# Altium project ePBR25_ACU_Latching.PrjPCB (part 2 of 2)

## Sheet 4e - Brake Detection.SchDoc
size A4
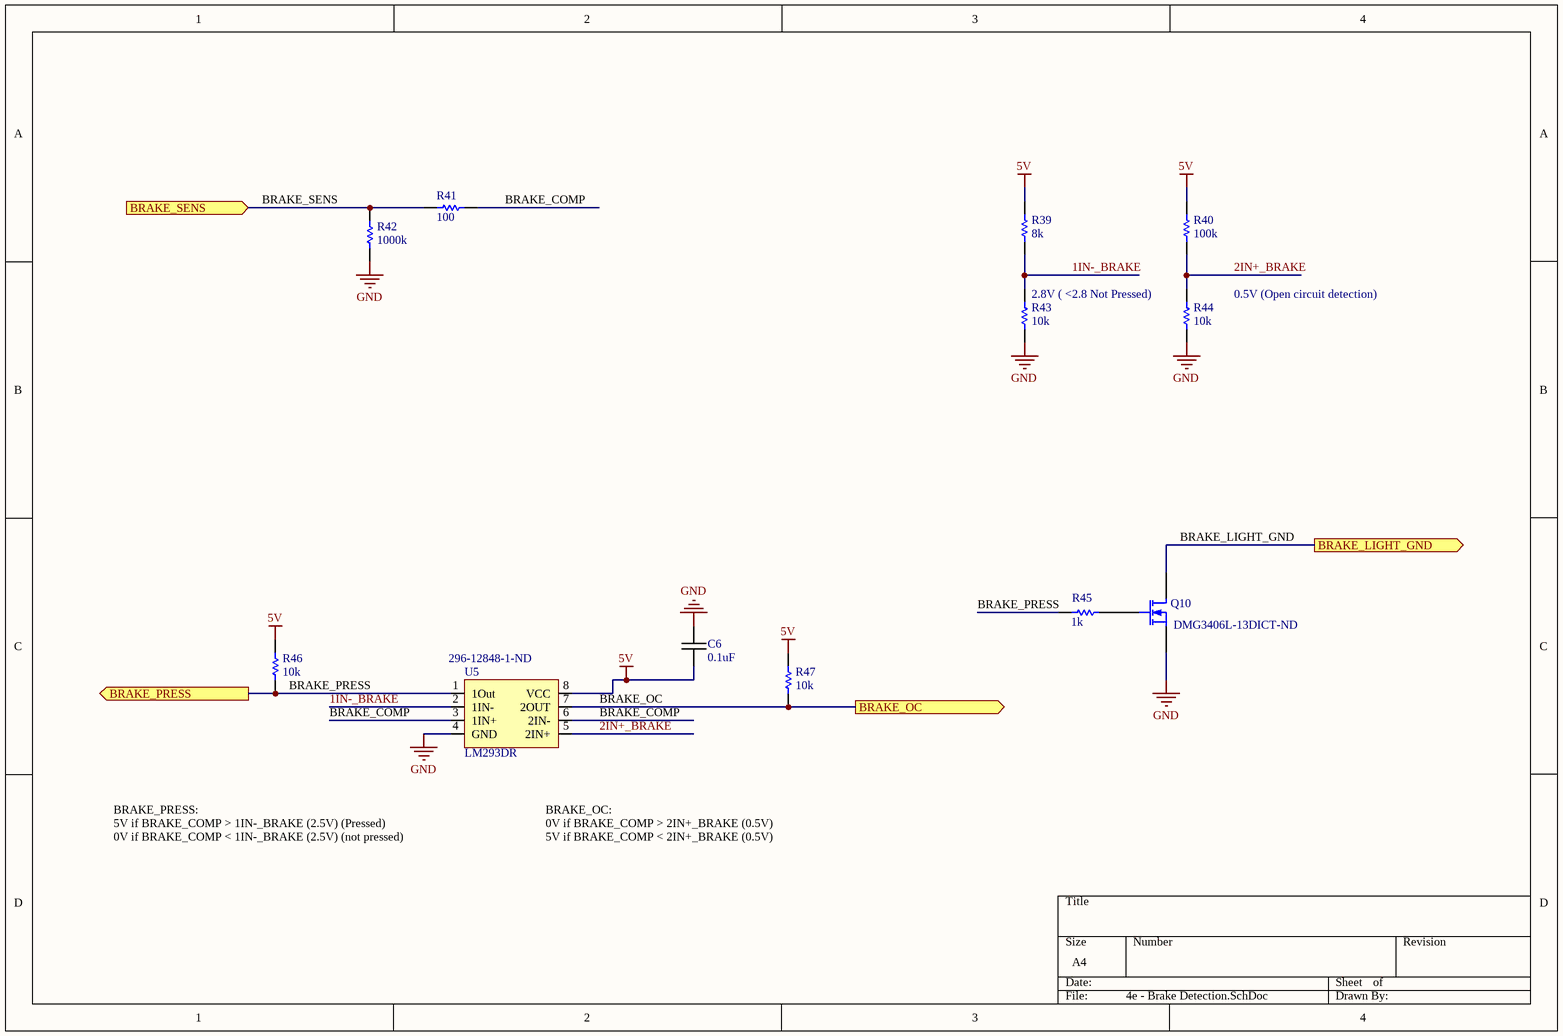
[diagram p5: 4e - Brake Detection.SchDoc]

### Parts
C6  value 0.1uF  [1608[0603]]  (hidden comment: 100nF)
Q10  Supplier Part Number 1: DMG3406L-13DICT-ND  [SOT-23_N]
R39  Resistance (Ohms): 8k  [1608[0603]]  (hidden comment: Volt. Div. R1)
R40  Resistance (Ohms): 100k  [1608[0603]]  (hidden comment: Volt. Div. R1)
R41  value 100  [1608[0603]]  (hidden comment: Volt. Div. R2)
R42  value 1000k  [1608[0603]]  (hidden comment: Volt. Div. R2)
R43  value 10k  [1608[0603]]  (hidden comment: Volt. Div. R2)
R44  value 10k  [1608[0603]]  (hidden comment: Volt. Div. R2)
R45  1k  [RESC0603(1608)_L]
R46  value 10k  [1608[0603]]  (hidden comment: Volt. Div. R2)
R47  value 10k  [1608[0603]]  (hidden comment: Volt. Div. R2)
U5  LM293DR  Supplier Part Number 1: 296-12848-1-ND  [LM293DR]

### Ports
BRAKE_LIGHT_GND (out), BRAKE_OC (out), BRAKE_PRESS (out), BRAKE_SENS (in)

### Nets
5V: C6.1 R39.2 R40.2 R46.2 R47.2 U5.8(VCC)
GND: C6.2 Q10.2(S) R42.1 R43.1 R44.1 U5.4(GND)
1IN-_BRAKE: R39.1 R43.2 U5.2(1IN-)
2IN+_BRAKE: R40.1 R44.2 U5.5(2IN+)
BRAKE_COMP: R41.1 U5.3(1IN+) U5.6(2IN-)
BRAKE_LIGHT_GND: Q10.3(D) ; port BRAKE_LIGHT_GND
BRAKE_OC: R47.1 U5.7(2OUT) ; port BRAKE_OC
BRAKE_PRESS: R45.1 R46.1 U5.1(1Out) ; port BRAKE_PRESS
BRAKE_SENS: R41.2 R42.2 ; port BRAKE_SENS
NetQ10_1: Q10.1(G) R45.2

### Notes on the sheet
- 2.8V ( <2.8 Not Pressed)
- 0.5V (Open circuit detection)
- BRAKE_PRESS:
  5V if BRAKE_COMP > 1IN-_BRAKE (2.5V) (Pressed)
  0V if BRAKE_COMP < 1IN-_BRAKE (2.5V) (not pressed)
- BRAKE_OC:
  0V if BRAKE_COMP > 2IN+_BRAKE (0.5V)
  5V if BRAKE_COMP < 2IN+_BRAKE (0.5V)

### Library data of the parts
C6 = 0805C-100nF-25V-X7R-MUR: CAP CER 0.1UF 50V X7R 0603; Manufacturer: Kemet; Manufacturer Part Number: C0603C104K5RACAUTO; Capacitance: 0.1µF; Tolerance: ±10%; Supplier 1: Digi-Key; Supplier Part Number 1: 399-6856-1-ND; RoHS: RoHS Compliant; Category: Capacitors; Stock 1: 157876; Pricing 1: 1=0.14, 10=0.095, 25=0.0672, 50=0.0514, 100=0.0435, 250=0.03556, 1000=0.02324 (CAD); Packaging: Cut Tape (CT); Voltage - Rated: 50V; Temperature Coefficient: X7R; Mounting Type: Surface Mount, MLCC; Operating Temperature: -55°C ~ 125°C; Applications: Automotive; Ratings: AEC-Q200; Package / Case: 0603 (1608 Metric); Size / Dimension: 0.063" L x 0.031" W (1.60mm x 0.80mm); Height - Seated (Max): -; Thickness (Max): 0.034" (0.87mm); Lead Spacing: -; Features: -; Lead Style: -; ComponentLink1URL: http://capacitoredge.kemet.com/capedge2/DataSheet?pn=C0603C104K5RACAUTO; ComponentLink1Description: http://capacitoredge.kemet.com/capedge2/DataSheet?pn=C0603C104K5RACAUTO
Q10 = MOSFET-N: N-Channel MOSFET; Manufacturer: Infineon Technologies; FET Type: MOSFET N-Channel, Metal Oxide; FET Feature: Logic Level Gate; Drain to Source Voltage (Vdss): 30V; Current - Continuous Drain (Id) @ 25°C: 50A (Tc); Rds On (Max) @ Id, Vgs: 7.5 mOhm @ 30A, 10V; Vgs(th) (Max) @ Id: 2.2V @ 250µA; Gate Charge (Qg) @ Vgs: 18nC @ 10V; Input Capacitance (Ciss) @ Vds: 1900pF @ 15V; Power - Max: 47W; Published: 8-Jun-2000; LatestRevisionDate: 17-Jul-2002; LatestRevisionNote: Re-released for DXP Platform.; PackageVersion: 1995/1996; PackageReference: E3; Publisher: Altium Limited; PackageDescription: TO, Flat Index; 3 In-Line, Axial Leads; Body Dia. 4.6mm; Lead Dia. 0.5 mm (max); RoHS: RoHS Compliant; Category: Discrete Semiconductor Products; Packaging: Cut Tape (CT); Mounting Type: Surface Mount; Package / Case: TO-252-3, DPak (2 Leads + Tab), SC-63; Supplier Device Package: PG-TO252-3; ComponentLink1URL: http://www.infineon.com/dgdl/Infineon-IPD075N03LG-DS-v02_01-en.pdf?folderId=5546d4694909da4801490a07012f053b&fileId=db3a30431936bc4b011951d824f83aeb; ComponentLink1Description: http://www.infineon.com/dgdl/Infineon-IPD075N03LG-DS-v02_01-en.pdf?folderId=5546d4694909da4801490a07012f053b&fileId=db3a30431936bc4b011951d824f83aeb; ComponentLink2URL: http://www.semicon.toshiba.co.jp/info/docget.jsp?type=datasheet&lang=en&pid=SSM3K329R; ComponentLink2Description: http://www.semicon.toshiba.co.jp/info/docget.jsp?type=datasheet&lang=en&pid=SSM3K329R; Supplier 1: Digi-Key
R39 R40 = Res1: RES SMD 6.8K OHM 5% 1/4W 0603; Manufacturer: Rohm Semiconductor; Manufacturer Part Number: ESR03EZPJ682; Power (Watts): 0.25W, 1/4W; Temperature Coefficient: ±200ppm/°C; RoHS: RoHS Compliant; Category: Resistors; Stock 1: 2440; Pricing 1: 1=0.15, 10=0.119, 25=0.0824, 50=0.0642, 100=0.0458, 250=0.03568, 500=0.02836, 1000=0.02012 (CAD); Packaging: Cut Tape (CT); Part Status: Active; Tolerance: ±5%; Composition: Thick Film; Features: Automotive AEC-Q200, Pulse Withstanding; Operating Temperature: -55°C ~ 155°C; Package / Case: 0603 (1608 Metric); Supplier Device Package: 0603; Size / Dimension: 0.063" L x 0.031" W (1.60mm x 0.80mm); Height - Seated (Max): 0.022" (0.55mm); Failure Rate: -; ComponentLink1URL: http://rohmfs.rohm.com/en/products/databook/datasheet/passive/resistor/chip_resistor/esr.pdf; ComponentLink1Description: http://rohmfs.rohm.com/en/products/databook/datasheet/passive/resistor/chip_resistor/esr.pdf; Supplier 1: Digi-Key
  R39: Supplier Part Number 1: 311-300KGRCT-ND
  R40: Supplier Part Number 1: 311-100KHRCT-ND
R41-R44 R46 R47 = Res1: RES SMD 20K OHM 5% 1/4W 0603; Manufacturer: Rohm Semiconductor; Manufacturer Part Number: ESR03EZPJ203; Power (Watts): 0.25W, 1/4W; Temperature Coefficient: ±200ppm/°C; Published: 8-Jun-2000; LatestRevisionDate: 17-Jul-2002; LatestRevisionNote: Re-released for DXP Platform.; PackageReference: AXIAL-0.3; Publisher: Altium Limited; PackageDescription: Axial Device, Thru-Hole; 2 Leads; 0.3 in Pin Spacing; RoHS: RoHS Compliant; Category: Resistors; Stock 1: 50602; Pricing 1: 1=0.15, 10=0.121, 25=0.0832, 100=0.0463, 250=0.03604, 500=0.02866, 1000=0.02033 (CAD); Packaging: Cut Tape (CT); Resistance (Ohms): 20k; Tolerance: ±5%; Composition: Thick Film; Features: Automotive AEC-Q200, Pulse Withstanding; Operating Temperature: -55°C ~ 155°C; Package / Case: 0603 (1608 Metric); Supplier Device Package: 0603 (1608 Metric); Size / Dimension: 0.063" L x 0.031" W (1.60mm x 0.80mm); Height: 0.022" (0.55mm); Number of Terminations: 2; ComponentLink1URL: http://rohmfs.rohm.com/en/products/databook/datasheet/passive/resistor/chip_resistor/esr.pdf; ComponentLink1Description: http://rohmfs.rohm.com/en/products/databook/datasheet/passive/resistor/chip_resistor/esr.pdf; Supplier 1: Digi-Key
  R41: Supplier Part Number 1: 311-100HRDKR-ND
  R42: Supplier Part Number 1: 311-1.00MHRCT-ND
  R43: Supplier Part Number 1: YAG3633CT-ND
  R44 R46 R47: Supplier Part Number 1: 311-10KGRCT-ND
R45 = CMP-1591-00001-1: 0603 (1608 Metric) Chip Resistor; Case-Metric: 1608; Case-EIA: 0603; Value: 1k; PackageReference: RESC0603(1608); Supplier 1: Digi-Key; Supplier Part Number 1: 311-1.0KGRCT-ND
U5 = LM293DR: IC Dual Comparator; Supplier 1: Digi-Key

## Sheet 5  - Status Lights.SchDoc
size 330 x 228 mm
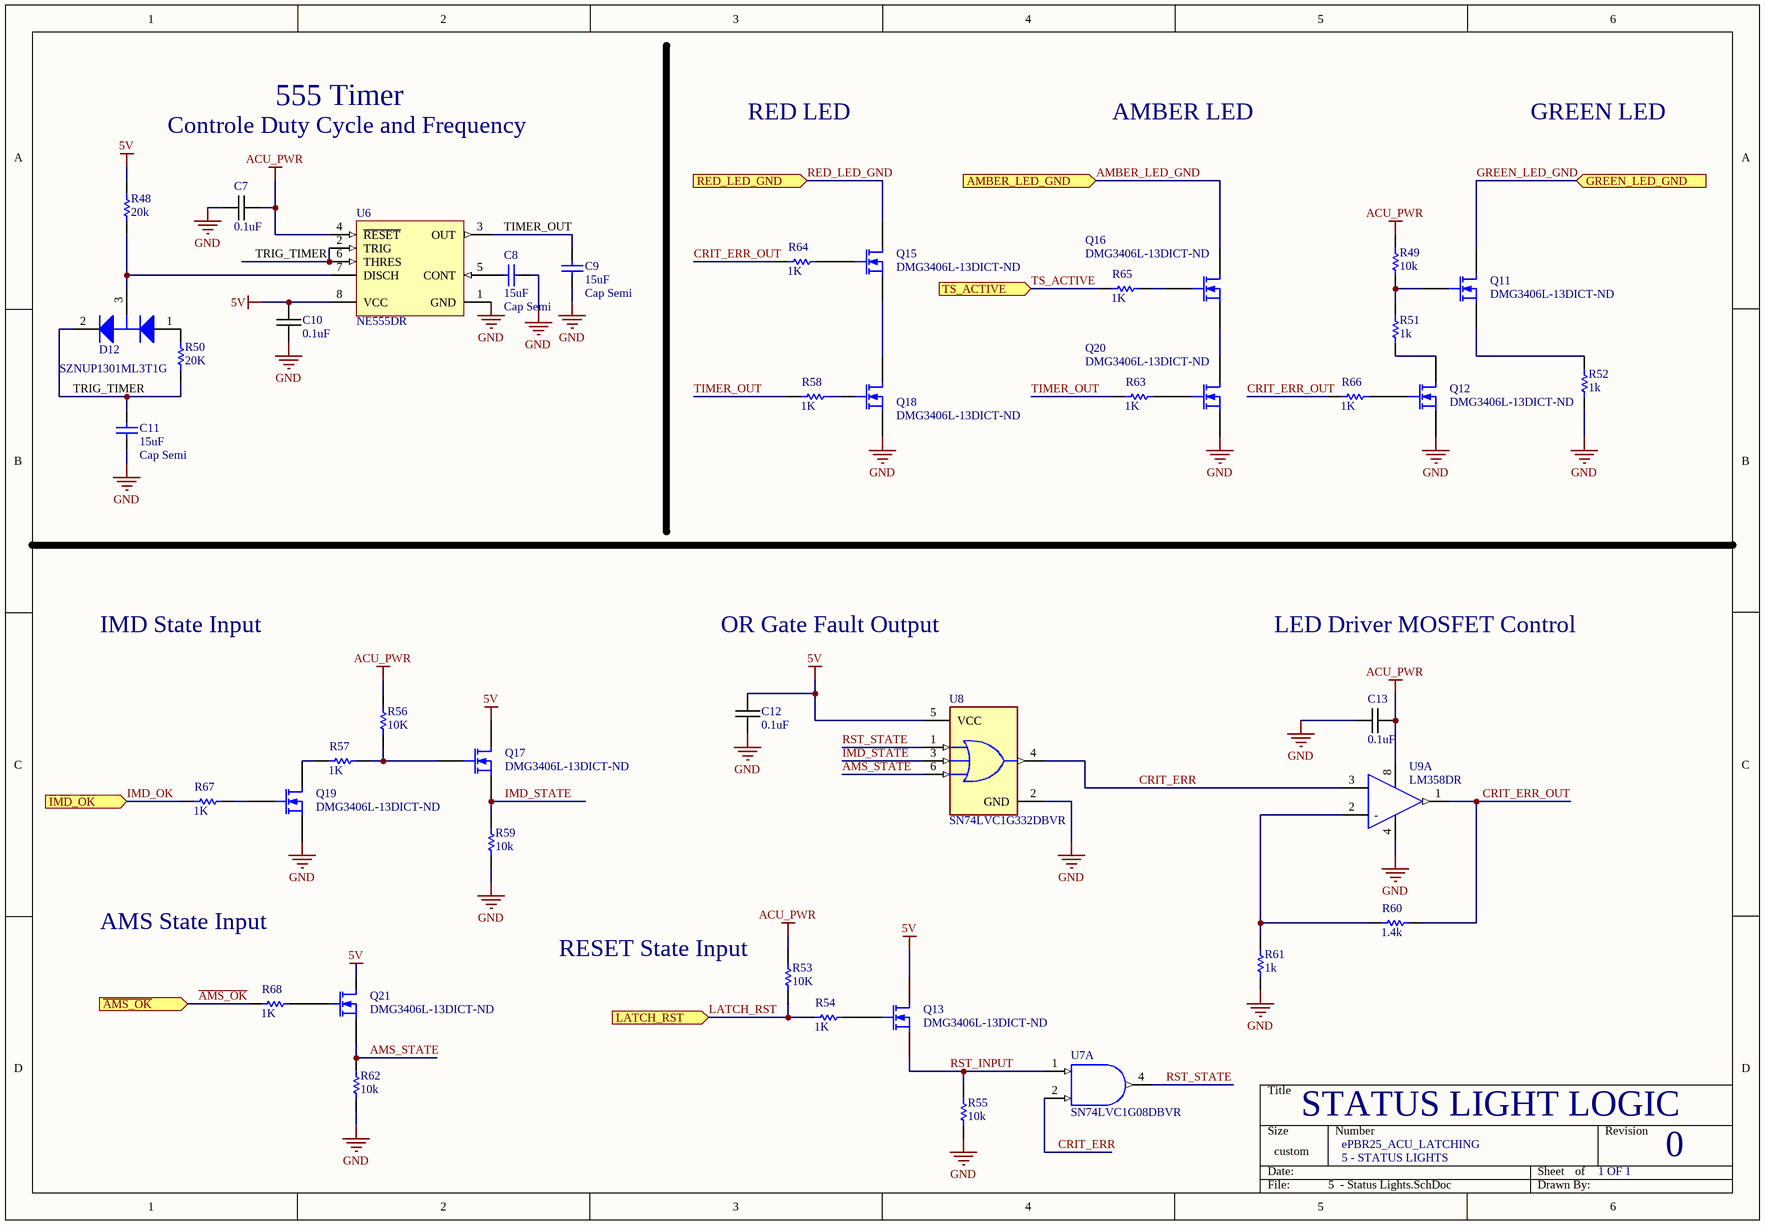
[diagram p6: 5  - Status Lights.SchDoc]

### Parts
C7  value 0.1uF  [1608[0603]]  (hidden comment: 100nF)
C8  Cap Semi  value 15uF  [1608[0603]]
C9  Cap Semi  value 15uF  [1608[0603]]
C10  value 0.1uF  [1608[0603]]  (hidden comment: 100nF)
C11  Cap Semi  value 15uF  [1608[0603]]
C12  value 0.1uF  [1608[0603]]  (hidden comment: 100nF)
C13  value 0.1uF  [1608[0603]]  (hidden comment: 100nF)
D12  SZNUP1301ML3T1G  [ONSC-SOT-23-3-318-08_V]
Q11  Supplier Part Number 1: DMG3406L-13DICT-ND  [SOT23-GDS]
Q12  Supplier Part Number 1: DMG3406L-13DICT-ND  [SOT23-GDS]
Q13  Supplier Part Number 1: DMG3406L-13DICT-ND  [SOT23-GDS]
Q15  Supplier Part Number 1: DMG3406L-13DICT-ND  [SOT23-GDS]
Q16  Supplier Part Number 1: DMG3406L-13DICT-ND  [SOT23-GDS]
Q17  Supplier Part Number 1: DMG3406L-13DICT-ND  [SOT23-GDS]
Q18  Supplier Part Number 1: DMG3406L-13DICT-ND  [SOT23-GDS]
Q19  Supplier Part Number 1: DMG3406L-13DICT-ND  [SOT23-GDS]
Q20  Supplier Part Number 1: DMG3406L-13DICT-ND  [SOT23-GDS]
Q21  Supplier Part Number 1: DMG3406L-13DICT-ND  [SOT23-GDS]
R48  20k  [RESC0603(1608)_L]
R49  10k  [RESC0603(1608)_L]
R50  20K  [RESC0603(1608)_L]
R51  1k  [RESC0603(1608)_L]
R52  1k  [RESC0603(1608)_L]
R53  10K  [RESC0603(1608)_L]
R54  1K  [RESC0603(1608)_L]
R55  10k  [RESC0603(1608)_L]
R56  10K  [RESC0603(1608)_L]
R57  1K  [RESC0603(1608)_L]
R58  1K  [RESC0603(1608)_L]
R59  10k  [RESC0603(1608)_L]
R60  1.4k  [RESC0603(1608)_L]
R61  1k  [RESC0603(1608)_L]
R62  10k  [RESC0603(1608)_L]
R63  1K  [RESC0603(1608)_L]
R64  1K  [RESC0603(1608)_L]
R65  1K  [RESC0603(1608)_L]
R66  1K  [RESC0603(1608)_L]
R67  1K  [RESC0603(1608)_L]
R68  1K  [RESC0603(1608)_L]
U6  NE555DR  [D0008A_M]
U7  SN74LVC1G08DBVR  [DBV0005A_M]  (part A of 2)
U8  SN74LVC1G332DBVR  [FP-DBV0006A-MFG]
U9  LM358DR  [FP-D0008A-MFG]  (part A of 2)

### Ports
AMBER_LED_GND (in), GREEN_LED_GND (in), IMD_OK (in), LATCH_RST (in), RED_LED_GND (in), TS_ACTIVE (in), ~{AMS_OK} (in)

### Nets
5V: C10.2 C12.1 Q13.3(D) Q17.3(D) Q21.3(D) R48.1 U6.8(VCC) U8.5(VCC)
ACU_PWR: C7.1 C13.2 R49.1 R53.2 R56.2 U6.4(~{RESET}) U9.8(V+)
GND: C7.2 C8.1 C9.2 C10.1 C11.2 C12.2 C13.1 Q12.2(S) Q18.2(S) Q19.2(S) Q20.2(S) R52.1 R55.2 R59.2 R61.2 R62.2 U6.1(GND) U8.2(GND) U9.4(V-)
~{AMS_OK}: R68.1 ; port ~{AMS_OK}
AMBER_LED_GND: Q16.3(D) ; port AMBER_LED_GND
AMS_STATE: Q21.2(S) R62.1 U8.6(C)
CRIT_ERR: U7.2(B) U8.4(Y) U9.3(IN1+)
CRIT_ERR_OUT: R60.2 R64.1 R66.1 U9.1(1OUT)
GREEN_LED_GND: Q11.3(D) ; port GREEN_LED_GND
IMD_OK: R67.1 ; port IMD_OK
IMD_STATE: Q17.2(S) R59.1 U8.3(B)
LATCH_RST: R53.1 R54.1 ; port LATCH_RST
RED_LED_GND: Q15.3(D) ; port RED_LED_GND
RST_INPUT: Q13.2(S) R55.1 U7.1(A)
RST_STATE: U7.4(Y) U8.1(A)
TIMER_OUT: C9.1 R58.1 R63.1 U6.3(OUT)
TRIG_TIMER: C11.1 D12.2(K) R50.1 U6.2(TRIG) U6.6(THRES)
TS_ACTIVE: R65.1 ; port TS_ACTIVE
NetC8_2: C8.2 U6.5(CONT)
NetD12_1: D12.1(A) R50.2
NetD12_3: D12.3(K/A) R48.2 U6.7(DISCH)
NetQ11_1: Q11.1(G) R49.2 R51.2
NetQ11_2: Q11.2(S) R52.2
NetQ12_1: Q12.1(G) R66.2
NetQ12_3: Q12.3(D) R51.1
NetQ13_1: Q13.1(G) R54.2
NetQ15_1: Q15.1(G) R64.2
NetQ15_2: Q15.2(S) Q18.3(D)
NetQ16_1: Q16.1(G) R65.2
NetQ16_2: Q16.2(S) Q20.3(D)
NetQ17_1: Q17.1(G) R56.1 R57.2
NetQ18_1: Q18.1(G) R58.2
NetQ19_1: Q19.1(G) R67.2
NetQ19_3: Q19.3(D) R57.1
NetQ20_1: Q20.1(G) R63.2
NetQ21_1: Q21.1(G) R68.2
NetR60_1: R60.1 R61.1 U9.2(IN1-)

### Notes on the sheet
- Controle Duty Cycle and Frequency
- 555 Timer
- RED LED
- AMBER LED
- GREEN LED
- IMD State Input
- OR Gate Fault Output
- LED Driver MOSFET Control
- AMS State Input
- (near R53) RESET State Input
- STATUS LIGHT LOGIC
- ePBR25_ACU_LATCHING
- 5 - STATUS LIGHTS
- 1 OF 1
- 0
- (in symbol CMP-1685-00009-2, part A) -

### Library data of the parts
C7 C10 C12 C13 = 0805C-100nF-25V-X7R-MUR: as C6 on sheet 4e - Brake Detection; Supplier 1: Digi-Key; Supplier Part Number 1: 399-6856-1-ND; RoHS: RoHS Compliant; Category: Capacitors; Stock 1: 157876; Pricing 1: 1=0.14, 10=0.095, 25=0.0672, 50=0.0514, 100=0.0435, 250=0.03556, 1000=0.02324 (CAD); Packaging: Cut Tape (CT); Voltage - Rated: 50V; Temperature Coefficient: X7R; Mounting Type: Surface Mount, MLCC; Operating Temperature: -55°C ~ 125°C; Applications: Automotive; Ratings: AEC-Q200; Package / Case: 0603 (1608 Metric); Size / Dimension: 0.063" L x 0.031" W (1.60mm x 0.80mm); Height - Seated (Max): -; Thickness (Max): 0.034" (0.87mm); Lead Spacing: -; Features: -; Lead Style: -; ComponentLink1URL: http://capacitoredge.kemet.com/capedge2/DataSheet?pn=C0603C104K5RACAUTO; ComponentLink1Description: http://capacitoredge.kemet.com/capedge2/DataSheet?pn=C0603C104K5RACAUTO
C8 C9 C11 = Cap Semi: Capacitor (Semiconductor SIM Model); Published: 8-Jun-2000; LatestRevisionDate: 29-May-2009; LatestRevisionNote: IPC-7351 Footprint Added.; PackageReference: C1206; Publisher: Altium Limited; PackageDescription: Chip Capacitor
D12 = CMP-1063-00171-1: Low Capacitance Diode Array for ESD Protection in a Single Data Line, 3-Pin SOT-23, Pb-Free, Tape and Reel; Manufacturer: On Semiconductor; C Max (pF): 0.9; Direction: Bidirectional; V(BR) Min (V): 70; Number of Lines: 1; Mounting Technology: Surface Mount; PackageReference: SOT-23-3-318-08; DatasheetVersion: Rev. 6; PackageVersion: Rev. AP, 11/2009; RoHS: Pb-Free; ComponentLink1Description: Manufacturer URL; ComponentLink1URL: http://www.onsemi.com/; PackageDescription: 3-Pin Small Outline Transistor, Body 2.92 x 1.3 mm, Pitch 0.95 mm; PartNumber: SZNUP1301ML3T1G; Packing: Tape and Reel; ComponentLink3URL: http://www.onsemi.cn/pub_link/Collateral/318-08.PDF; ComponentLink3Description: Package Specification; VRWM Max (V): 70; ComponentLink2Description: Datasheet; ComponentLink2URL: http://www.onsemi.cn/pub_link/Collateral/NUP1301ML3T1-D.PDF; Supplier 1: Digi-Key; Supplier Part Number 1: SZNUP1301ML3T1GOSCT-ND
Q11-Q13 Q15-Q21 = MOSFET-N: as Q10 on sheet 4e - Brake Detection; Published: 8-Jun-2000; LatestRevisionDate: 17-Jul-2002; LatestRevisionNote: Re-released for DXP Platform.; PackageVersion: 1995/1996; PackageReference: E3; Publisher: Altium Limited; PackageDescription: TO, Flat Index; 3 In-Line, Axial Leads; Body Dia. 4.6mm; Lead Dia. 0.5 mm (max); RoHS: RoHS Compliant; Category: Discrete Semiconductor Products; Packaging: Cut Tape (CT); Mounting Type: Surface Mount; Package / Case: TO-252-3, DPak (2 Leads + Tab), SC-63; Supplier Device Package: PG-TO252-3; ComponentLink1URL: http://www.infineon.com/dgdl/Infineon-IPD075N03LG-DS-v02_01-en.pdf?folderId=5546d4694909da4801490a07012f053b&fileId=db3a30431936bc4b011951d824f83aeb; ComponentLink1Description: http://www.infineon.com/dgdl/Infineon-IPD075N03LG-DS-v02_01-en.pdf?folderId=5546d4694909da4801490a07012f053b&fileId=db3a30431936bc4b011951d824f83aeb; ComponentLink2URL: http://www.semicon.toshiba.co.jp/info/docget.jsp?type=datasheet&lang=en&pid=SSM3K329R; ComponentLink2Description: http://www.semicon.toshiba.co.jp/info/docget.jsp?type=datasheet&lang=en&pid=SSM3K329R; Supplier 1: Digi-Key
R48-R50 R53 R55 R56 R59 R60 R62 = CMP-1591-00001-1: 0603 (1608 Metric) Chip Resistor; Value: 1k; Case-Metric: 1608; Case-EIA: 0603; PackageReference: RESC0603(1608); Supplier 1: Digi-Key
  R48: Supplier Part Number 1: 311-10KGRCT-ND
  R49 R53 R55 R56 R59 R60 R62: Supplier Part Number 1: 311-1.0KGRCT-ND
  R50: Supplier Part Number 1: 311-27KGRCT-ND
R51 R52 R54 R57 R58 R61 R63-R68 = CMP-1591-00001-1: as R45 on sheet 4e - Brake Detection; Value: 1k; PackageReference: RESC0603(1608); Supplier 1: Digi-Key; Supplier Part Number 1: 311-1.0KGRCT-ND
U6 = CMP-1685-00007-1: Precision Timer, 4.5 to 16 V, 0 to 70 degC, 8-Pin SOIC (D8), Green (RoHS & no Sb/Br), Tape and Reel; Forward Voltage: 450 mV; Forward Current: 1 A; Max Surge Current: 30 A; Peak Reverse Current: 500 uA; Case\Package: SMA; PackageReference: D0008A; Width: 2.84 mm; PackageDescription: 8-Pin Small Outline Integrated Circuit, Body 4.9 x 3.9 mm, Pitch 1.27 mm; DatasheetVersion: SLFS022I, 09/2014; ComponentLink2Description: Datasheet; Package Quantity: 1; REACH SVHC: Unknown; Radiation Hardening: No; Height: 2.44 mm; Code_JEDEC: MS-012; Pins: 2; ComponentLink1Description: Manufacturer URL; ComponentLink3Description: Package Specification; ComponentLink3URL: http://www.ti.com/lit/ml/msoi002j/msoi002j.pdf; Length: 4.57 mm; ComponentLink1URL: http://www.ti.com/; Mount: Surface Mount; PackageVersion: 4040047-3/M, 06/2011; ComponentLink2URL: http://www.ti.com/general/docs/lit/getliterature.tsp?genericPartNumber=NE555&fileType=pdf; RoHSCompliant: true; Max Operating Temperature: 125 degC; Packaging: Cut Tape; Min Operating Temperature: -55 degC; Supplier 1: Digi-Key; Supplier Part Number 1: 296-6501-2-ND
U7 = CMP-0859-00053-3: Single 2-Input Positive-AND Gate, DBV0005A, LARGE T&R; Manufacturer: Texas Instruments; Logic: True; ICC @ Nom Voltage(Max)(mA): 0.01; VCC(Min)(V): 1.65; Bits(#): 1; Rating: Catalog; Schmitt Trigger: No; Voltage(Nom)(V): 1.8,2.5,3.3,5; Output Drive (IOL/IOH)(Max)(mA): 32/-32; Gate Type: AND; tpd @ Nom Voltage(Max)(ns): 4.5,6,4,5; VCC(Max)(V): 5.5; Output Type: CMOS; F @ Nom Voltage(Max)(Mhz): 150; Input Type: CMOS/TTL; Technology Family: LVC; Sub-Family: AND Gate; PackageReference: DBV0005A; Generic Part Number: SN74LVC1G08; Operating Temperature Range(C): -40 to 125,-40 to 85; 3-State Output: No; DatasheetVersion: SCES217Y
U8 = CMP-0859-00188-4: IC GATE OR 1CH 3-INP SOT23-6; Manufacturer: TEXAS INSTRUMENTS; Number Of Inputs: 3; Nominal Supply Current: 10-500uA; Number Of Circuits: 1; Max Supply Voltage: 5.5V; Standoff Height: 0mm; Propagation Delay: 4.5ns; Min Supply Voltage: 1.5V; Height: 1.45mm; Temperature Range High: +125°C; Device Class L3: Logic Gates; Device Class L2: Logic ICs; Lead Free: Yes; Temperature Range Low: -40°C; ComponentLink2URL: http://www.ti.com/lit/ds/symlink/sn74lvc1g332.pdf; Package: DBV0006A; ComponentLink2Description: Datasheet; Octopart: https://octopart.com/sn74lvc1g332dbvr-texas+instruments-464996; Category: IC; Automotive: No; Manufacturer Part Number: SN74LVC1G332DBVR; Ipc Land Pattern Name: SOT95P280X145-6; Logic Function Desc: OR; Ambient Temperature Range Low: -40°C; Temperature: -40°C to +125°C; Number Of Outputs: 1; Mouser Description: Logic Gates Sngl 3 Inpt + OR Gt; RoHS: TRUE; Ambient Temperature Range High: +125°C; Device Class L1: Integrated Circuits (ICs); Digikey Description: IC GATE OR 1CH 3-INP SOT23-6
U9 = CMP-1685-00009-2: IC OPAMP GP 2 CIRCUIT 8SOIC; Output Current: 30mA; Min Dual Supply Voltage: 1.5V; Input Offset Voltage (Vos): 7mV; Power Supply Rejection Ratio (PSRR): 65dB; Unity Gain Bandwidth Product: 700kHz; Number of Channels: 2; Min Supply Voltage: 3V; Max Dual Supply Voltage: 16V; Dual Supply Voltage: 9V; Max Supply Voltage: 32V; Nominal Supply Current: 1.2mA; Slew Rate: 0.3V/µs; Input Bias Current: 250nA; Voltage Gain: 100dB; Operating Supply Current: 1mA; REACH SVHC: No SVHC; Package Quantity: 2500; Width: 3.91mm; Max Operating Temperature: 70°C; Min Operating Temperature: 0°C; Mount: Surface Mount; Length: 4.9mm; Radiation Hardening: No; Case/Package: SOIC; Lead Free: Lead Free; Number of Elements: 2; Packaging: Tape and Reel; Output Current per Channel: 30mA; Number of Circuits: 2; Bandwidth: 700kHz; Operating Supply Voltage: 16V; Gain Bandwidth Product: 700kHz; Number of Pins: 8; Number of Amplifiers: 2; Height: 1.58mm; Common Mode Rejection Ratio: 65dB; Contact Plating: Gold

## Nets that join several sheets
5V: 4  - Latching (D1.2 J2.A2), 4d - BSPD Detection Timer (11 pins), 4e - Brake Detection (6 pins), 5  - Status Lights (8 pins)
ACU_PWR: 4  - Latching (J1.A1), 5  - Status Lights (7 pins)
GND: 4  - Latching (5 pins), 4b - Latching IMD (5 pins), 4c - Latching BSPD (BSPD.24 Q8.2 Q9.2 R20.1), 4a - Latching AMS (AMS.24 Q2.2 Q3.2 R6.1), 4d - BSPD Detection Timer (14 pins), 4e - Brake Detection (6 pins), 5  - Status Lights (19 pins)
LATCHING_Delayed: 4  - Latching (J4.A3), 4b - Latching IMD (5 pins), 4c - Latching BSPD (6 pins), 4a - Latching AMS (7 pins)
~{AMS_OK}: 4  - Latching (J4.A2), 4a - Latching AMS (R5.1 R8.1), 5  - Status Lights (R68.1)
AMBER_LED_GND: 4  - Latching (J1.A4), 5  - Status Lights (Q16.3)
AMS_LED: 4  - Latching (J4.A1), 4a - Latching AMS (AMS.21 D2.2)
AMS_OK: 4  - Latching (J4.A4), 4a - Latching AMS (Q2.3 R2.2 R4.1)
~{BSPD_OK}: 4c - Latching BSPD (R19.1 R22.1), 4d - BSPD Detection Timer (U3.4)
BRAKE_LIGHT_GND: 4  - Latching (J2.A6), 4e - Brake Detection (Q10.3)
BRAKE_OC: 4d - BSPD Detection Timer (U3.3), 4e - Brake Detection (R47.1 U5.7)
BRAKE_PRESS: 4  - Latching (J2.A3), 4d - BSPD Detection Timer (U4.1), 4e - Brake Detection (R45.1 R46.1 U5.1)
BRAKE_SENS: 4  - Latching (J2.A4), 4e - Brake Detection (R41.2 R42.2)
BSPD_LED: 4  - Latching (J3.A4), 4c - Latching BSPD (BSPD.21 D8.2)
GREEN_LED_GND: 4  - Latching (J1.A3), 5  - Status Lights (Q11.3)
IMD_LED: 4  - Latching (J4.A6), 4b - Latching IMD (D6.2 IMD.21)
IMD_OK: 4  - Latching (J3.A5), 4b - Latching IMD (R10.1 R14.2 R15.1), 5  - Status Lights (R67.1)
LATCH_RST: 4  - Latching (J3.A2), 4b - Latching IMD (Q4.2 R11.2), 4c - Latching BSPD (Q7.2 R20.2), 4a - Latching AMS (Q1.2 R6.2), 5  - Status Lights (R53.1 R54.1)
RED_LED_GND: 4  - Latching (J1.A2), 5  - Status Lights (Q15.3)
SCHT_AMS_IMD: 4  - Latching (JMP1.1 JMP2.2), 4b - Latching IMD (IMD.12), 4a - Latching AMS (AMS.11)
SCHT_IMD_BSPD: 4  - Latching (JMP2.1 JMP3.2), 4b - Latching IMD (IMD.11), 4c - Latching BSPD (BSPD.12)
SCHT_IN_LATCH: 4  - Latching (J4.A5 JMP1.2), 4a - Latching AMS (AMS.12)
SCHT_OUT_LATCH: 4  - Latching (J3.A1 JMP3.1), 4c - Latching BSPD (BSPD.11)
TS_ACTIVE: 4  - Latching (J1.A5), 5  - Status Lights (R65.1)
TS_CURR_SENS: 4  - Latching (J2.A1), 4d - BSPD Detection Timer (R28.2 R30.2)